# EAGLE schematic Pic18F4525 (EAGLE 5.04)
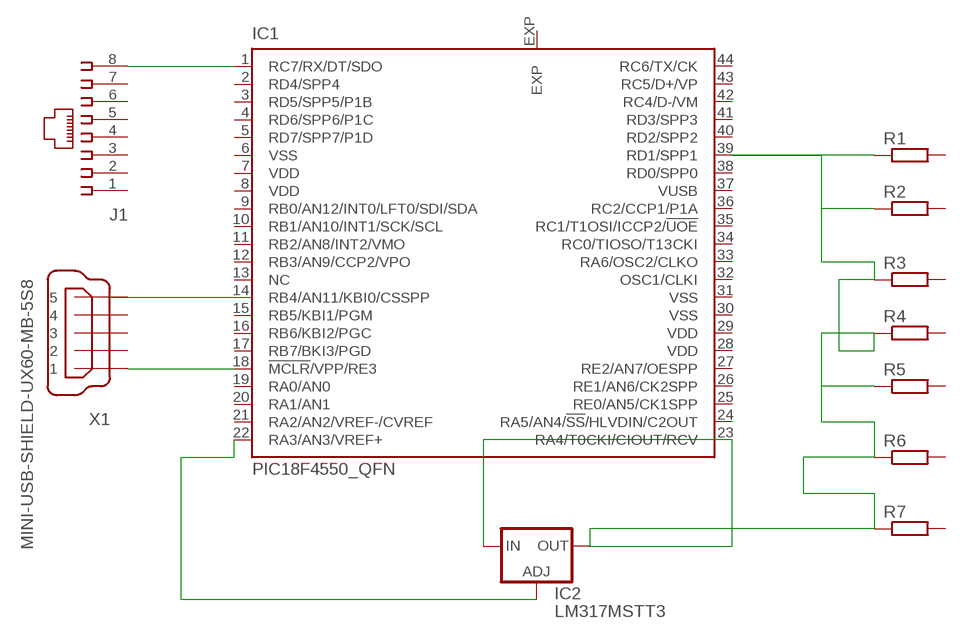
[diagram p0: schematic, sheet 1]

## Parts
IC1  PIC18F4550_QFN  [QFN44ML8X8]
IC2  LM317MSTT3  [SOT223]
J1  520243-4  [520243-4]
R1  R-EU_M0805  [M0805]
R2  R-EU_M0805  [M0805]
R3  R-EU_M0805  [M0805]
R4  R-EU_M0805  [M0805]
R5  R-EU_M0805  [M0805]
R6  R-EU_M0805  [M0805]
R7  R-EU_M0805  [M0805]
X1  MINI-USB-SHIELD-UX60-MB-5S8  [UX60-MB-5S8]

## Nets
N$1: IC1.23(RA4/T0CKI/CIOUT/RCV) IC1.39(RD1/SPP1) IC2.3(IN) IC2.4(OUT) R1.1 R2.1 R3.1 R4.1 R5.1 R6.1 R7.1
N$2: IC1.22(RA3/AN3/VREF+) IC2.1(ADJ)
N$3: IC1.1(RC7/RX/DT/SDO) J1.8
N$5: IC1.18(!MCLR!/VPP/RE3) X1.1
Unconnected: IC1.2(RD4/SPP4) IC1.3(RD5/SPP5/P1B) IC1.4(RD6/SPP6/P1C) IC1.5(RD7/SPP7/P1D) IC1.9(RB0/AN12/INT0/LFT0/SDI/SDA) IC1.10(RB1/AN10/INT1/SCK/SCL) IC1.11(RB2/AN8/INT2/VMO) IC1.12(RB3/AN9/CCP2/VPO) IC1.13(NC) IC1.14(RB4/AN11/KBI0/CSSPP) IC1.15(RB5/KBI1/PGM) IC1.16(RB6/KBI2/PGC) IC1.17(RB7/BKI3/PGD) IC1.19(RA0/AN0) IC1.20(RA1/AN1) IC1.21(RA2/AN2/VREF-/CVREF) IC1.24(RA5/AN4/!SS!/HLVDIN/C2OUT) IC1.25(RE0/AN5/CK1SPP) IC1.26(RE1/AN6/CK2SPP) IC1.27(RE2/AN7/OESPP) IC1.32(OSC1/CLKI) IC1.33(RA6/OSC2/CLKO) IC1.34(RC0/TIOSO/T13CKI) IC1.35(RC1/T1OSI/ICCP2/!UOE) IC1.36(RC2/CCP1/P1A) IC1.37(VUSB) IC1.38(RD0/SPP0) IC1.40(RD2/SPP2) IC1.41(RD3/SPP3) IC1.42(RC4/D-/VM) IC1.43(RC5/D+/VP) IC1.44(RC6/TX/CK) IC1.EXP J1.1 J1.2 J1.3 J1.4 J1.5 J1.6 J1.7 R1.2 R2.2 R3.2 R4.2 R5.2 R6.2 R7.2 X1.2 X1.3 X1.4 X1.5 X1.M1(S1) X1.M2(S2) X1.M3(S3) X1.M4(S4)

## Power pins joined to a net without a drawn wire
VDD: IC1.7(VDD) IC1.8(VDD) IC1.28(VDD) IC1.29(VDD)
VSS: IC1.6(VSS) IC1.30(VSS) IC1.31(VSS)

## Library data of the parts
IC1 = microchip:PIC18F4*_QFN: USB Microcontrollers with nanoWatt Technology High-Performance, Enhanced Flash, 28/40/44-Pin, Source: http://ww1.microchip.com/downloads/en/devicedoc/39632c.pdf
IC2 = v-reg:LM317?*: 500 mA Adjustable Output Positive Voltage Regulator Source: http://www.onsemi.co.jp .. LM317M-D.PDF
J1 = con-amp:520243-4: AMP connector
R1-R7 = resistor:R-EU_: RESISTOR, European symbol
X1 = con-hirose:MINI-USB-SHIELD-: MINI USB Connector Source: http://www.hirose.co.jp/cataloge_hp/e24000019.pdf